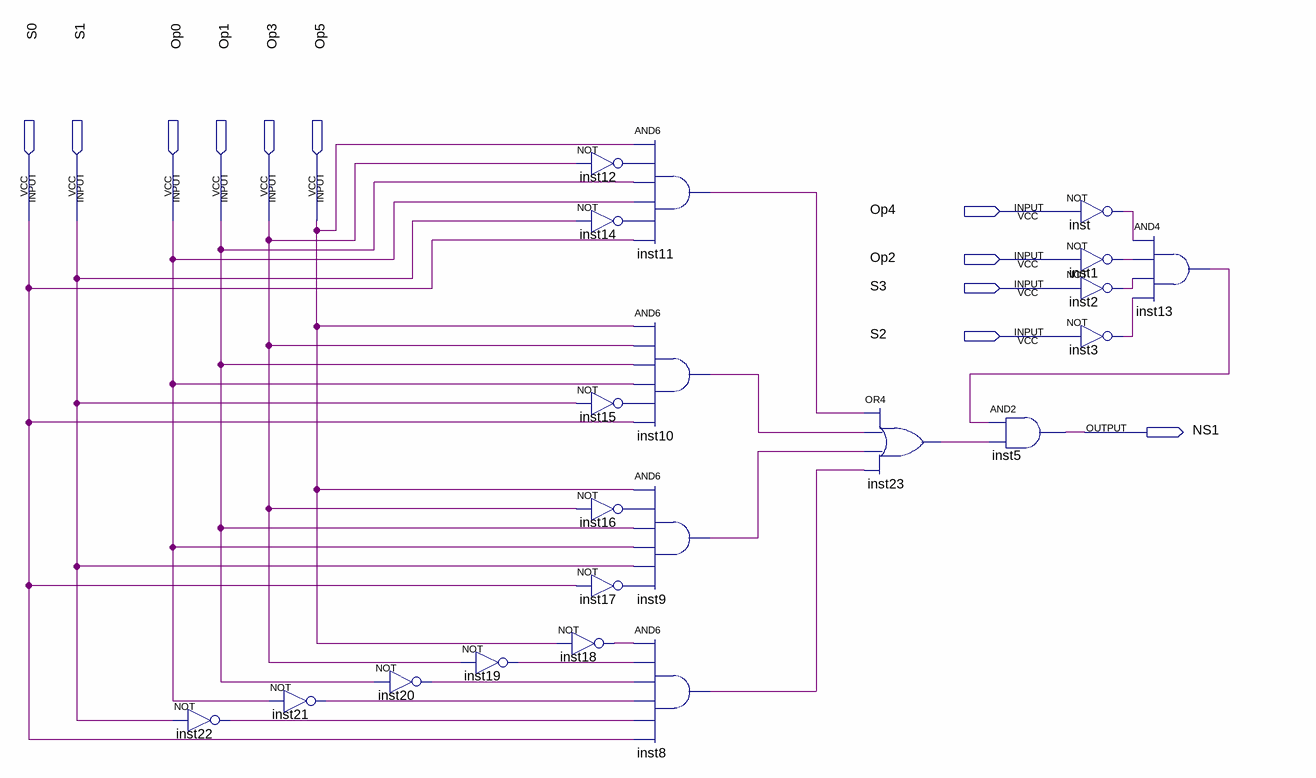
[diagram p0: schematic sheet]
// Quartus schematic NS1.bdf as structural Verilog: 21 symbols, 11 pins
module NS1 (
  input  Op4,
  input  S0,
  input  S1,
  input  Op0,
  input  Op1,
  input  Op3,
  input  Op5,
  input  Op2,
  input  S3,
  input  S2,
  output NS1
);

  wire inst1_out, inst2_out, inst3_out, inst8_out, inst9_out, inst10_out, inst11_out, inst12_out, inst13_out,
       inst14_out, inst15_out, inst16_out, inst17_out, inst18_out, inst19_out, inst20_out, inst21_out,
       inst22_out, inst23_out, inst_out;

  not inst22 (inst22_out, S1);
  not inst21 (inst21_out, Op0);
  not inst20 (inst20_out, Op1);
  not inst19 (inst19_out, Op3);
  not inst12 (inst12_out, Op3);
  not inst14 (inst14_out, S1);
  not inst15 (inst15_out, S1);
  not inst16 (inst16_out, Op3);
  not inst17 (inst17_out, S0);
  not inst18 (inst18_out, Op5);
  and inst11 (inst11_out, Op5, inst12_out, Op1, Op0, inst14_out, S0);
  and inst10 (inst10_out, Op5, Op3, Op1, Op0, inst15_out, S0);
  and inst9 (inst9_out, Op5, inst16_out, Op1, Op0, S1, inst17_out);
  and inst8 (inst8_out, inst18_out, inst19_out, inst20_out, inst21_out, inst22_out, S0);
  or inst23 (inst23_out, inst11_out, inst10_out, inst9_out, inst8_out);
  and inst5 (NS1, inst13_out, inst23_out);
  not inst (inst_out, Op4);
  and inst13 (inst13_out, inst_out, inst1_out, inst2_out, inst3_out);
  not inst1 (inst1_out, Op2);
  not inst2 (inst2_out, S3);
  not inst3 (inst3_out, S2);
endmodule
